# EAGLE design HV-PCB (EAGLE 7.7.0)
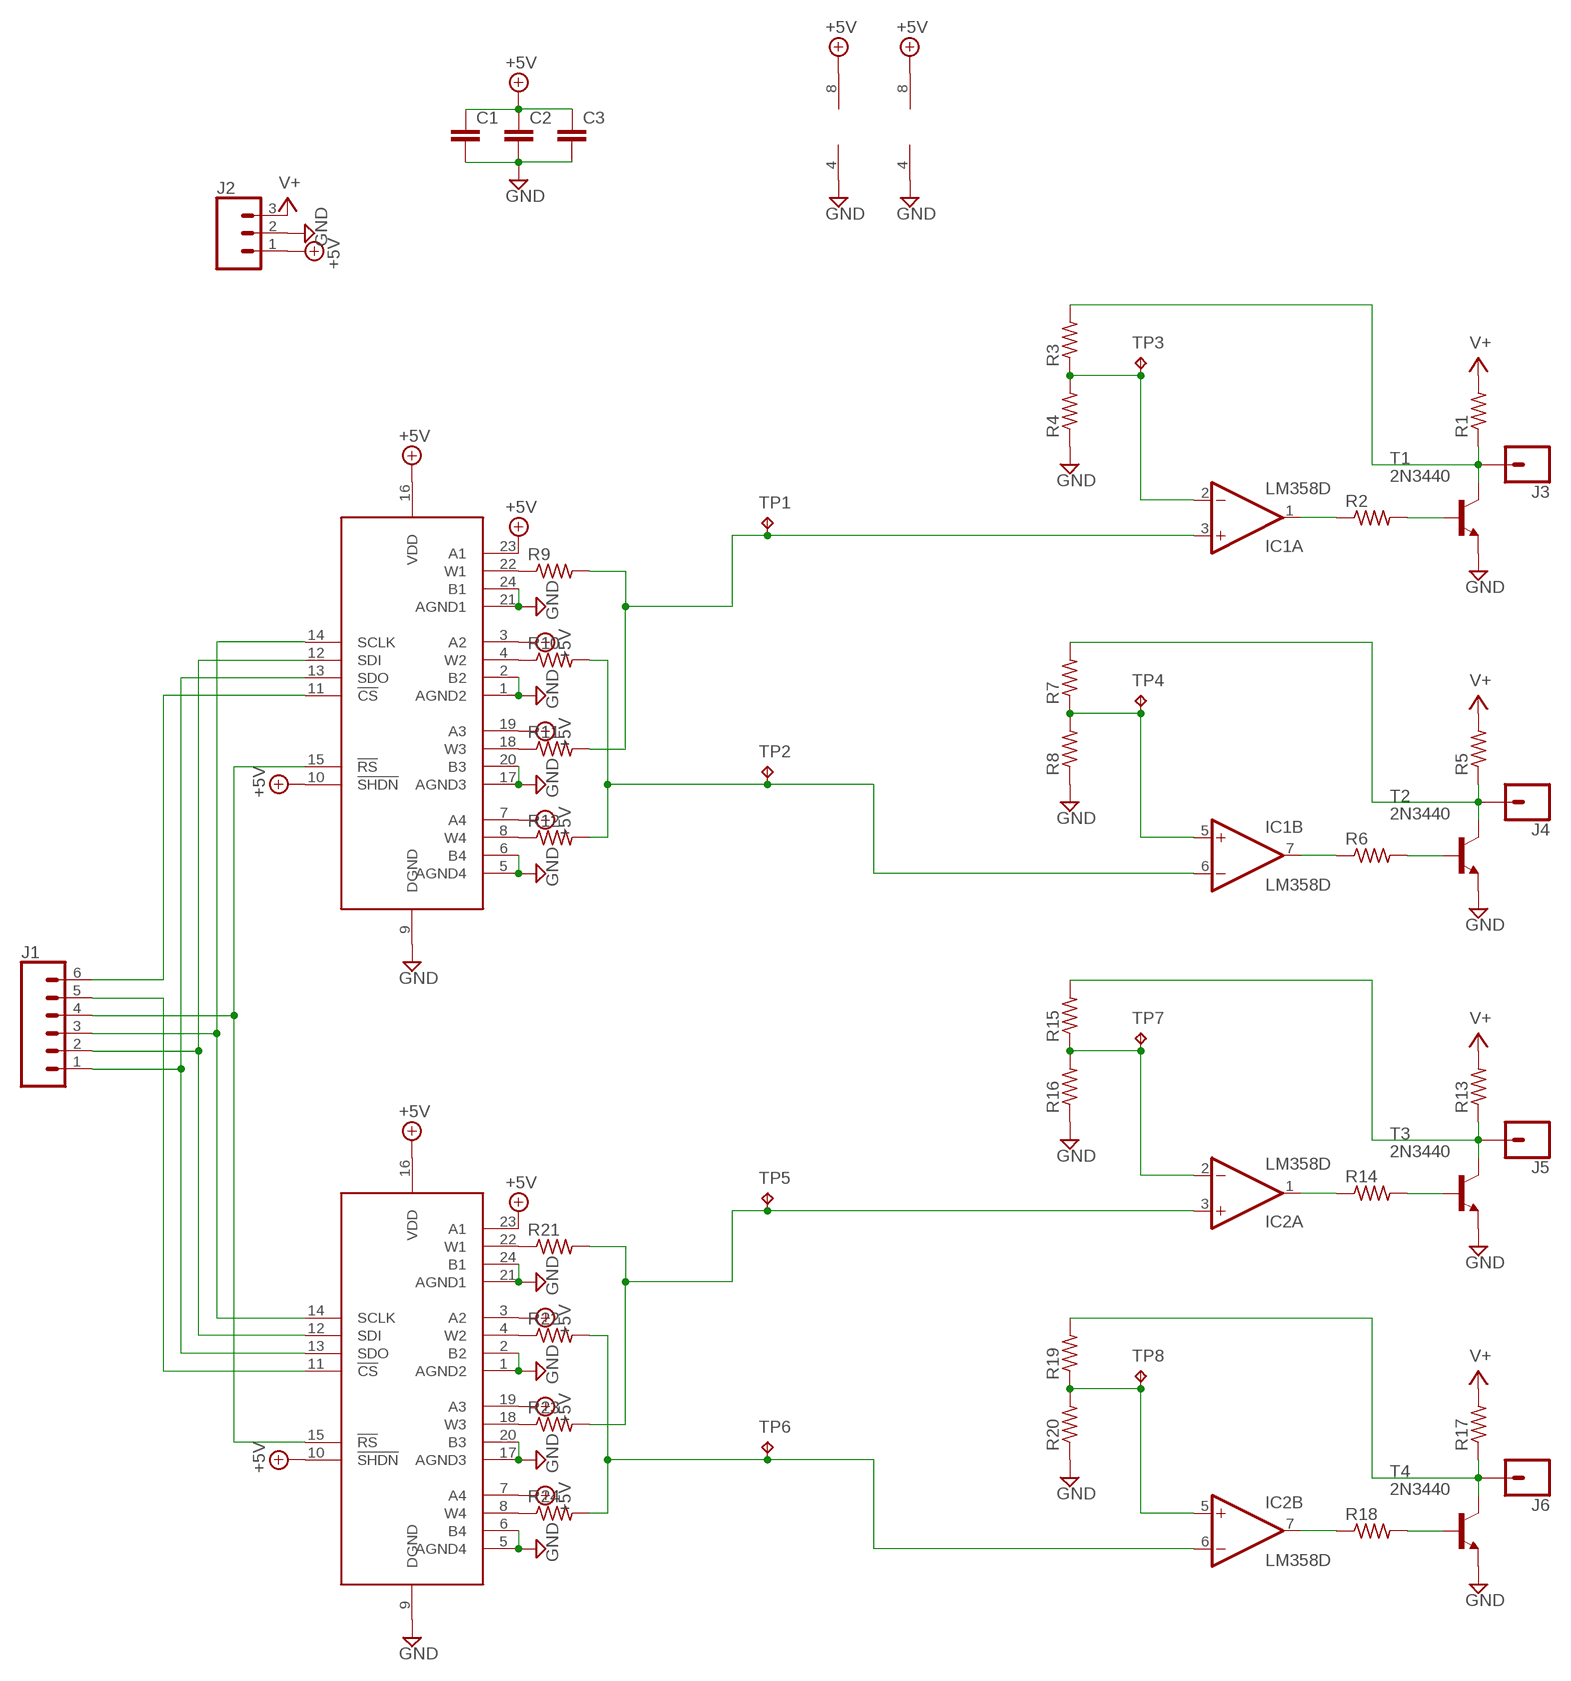
[diagram p0: schematic, sheet 1]

## Parts
C1  C-EUC1206K  [C1206K]
C2  C-EUC1206K  [C1206K]
C3  C-EUC1206K  [C1206K]
IC1  LM358D  [SO08]
IC2  LM358D  [SO08]
J1  CONN_06SILK_FEMALE_PTH  [1X06]
J2  CONN_03  [1X03]
J3  CONN_01  [1X01]
J4  CONN_01  [1X01]
J5  CONN_01  [1X01]
J6  CONN_01  [1X01]
R1  R-US_M1206  [M1206]
R2  R-US_M1206  [M1206]
R3  R-US_M1206  [M1206]
R4  R-US_M1206  [M1206]
R5  R-US_M1206  [M1206]
R6  R-US_M1206  [M1206]
R7  R-US_M1206  [M1206]
R8  R-US_M1206  [M1206]
R9  R-US_M1206  [M1206]
R10  R-US_M1206  [M1206]
R11  R-US_M1206  [M1206]
R12  R-US_M1206  [M1206]
R13  R-US_M1206  [M1206]
R14  R-US_M1206  [M1206]
R15  R-US_M1206  [M1206]
R16  R-US_M1206  [M1206]
R17  R-US_M1206  [M1206]
R18  R-US_M1206  [M1206]
R19  R-US_M1206  [M1206]
R20  R-US_M1206  [M1206]
R21  R-US_M1206  [M1206]
R22  R-US_M1206  [M1206]
R23  R-US_M1206  [M1206]
R24  R-US_M1206  [M1206]
T1  2N3440  [TO5]
T2  2N3440  [TO5]
T3  2N3440  [TO5]
T4  2N3440  [TO5]
TP1  TPB1,27  [B1,27]
TP2  TPB1,27  [B1,27]
TP3  TPB1,27  [B1,27]
TP4  TPB1,27  [B1,27]
TP5  TPB1,27  [B1,27]
TP6  TPB1,27  [B1,27]
TP7  TPB1,27  [B1,27]
TP8  TPB1,27  [B1,27]
U$1  AD8403  [SO24L]
U$2  AD8403  [SO24L]

## Nets
!RST: J1.4 U$1.15(!RS) U$2.15(!RS)
+5V: C1.1 C2.1 C3.1 IC1.8(P:V+) IC2.8(P:V+) J2.1 U$1.3(A2) U$1.7(A4) U$1.10(!SHDN) U$1.16(VDD) U$1.19(A3) U$1.23(A1) U$2.3(A2) U$2.7(A4) U$2.10(!SHDN) U$2.16(VDD) U$2.19(A3) U$2.23(A1)
GND: C1.2 C2.2 C3.2 IC1.4(P:V-) IC2.4(P:V-) J2.2 R4.1 R8.1 R16.1 R20.1 T1.1(E) T2.1(E) T3.1(E) T4.1(E) U$1.1(AGND2) U$1.2(B2) U$1.5(AGND4) U$1.6(B4) U$1.9(DGND) U$1.17(AGND3) U$1.20(B3) U$1.21(AGND1) U$1.24(B1) U$2.1(AGND2) U$2.2(B2) U$2.5(AGND4) U$2.6(B4) U$2.9(DGND) U$2.17(AGND3) U$2.20(B3) U$2.21(AGND1) U$2.24(B1)
N$1: J3.1 R1.1 R3.2 T1.3(C)
N$2: R2.2 T1.2(B)
N$3: IC1.1(A:OUT) R2.1
N$4: IC1.2(A:-IN) R3.1 R4.2 TP3.TP
N$5: J4.1 R5.1 R7.2 T2.3(C)
N$6: R6.2 T2.2(B)
N$7: IC1.7(B:OUT) R6.1
N$8: IC1.5(B:+IN) R7.1 R8.2 TP4.TP
N$9: R9.1 U$1.22(W1)
N$10: R10.1 U$1.4(W2)
N$11: IC1.3(A:+IN) R9.2 R11.2 TP1.TP
N$12: IC1.6(B:-IN) R10.2 R12.2 TP2.TP
N$13: R11.1 U$1.18(W3)
N$14: R12.1 U$1.8(W4)
N$15: J5.1 R13.1 R15.2 T3.3(C)
N$16: R14.2 T3.2(B)
N$17: IC2.1(A:OUT) R14.1
N$18: IC2.2(A:-IN) R15.1 R16.2 TP7.TP
N$19: J6.1 R17.1 R19.2 T4.3(C)
N$20: R18.2 T4.2(B)
N$21: IC2.7(B:OUT) R18.1
N$22: IC2.5(B:+IN) R19.1 R20.2 TP8.TP
N$23: R21.1 U$2.22(W1)
N$24: R22.1 U$2.4(W2)
N$25: IC2.3(A:+IN) R21.2 R23.2 TP5.TP
N$26: R23.1 U$2.18(W3)
N$27: R24.1 U$2.8(W4)
N$28: IC2.6(B:-IN) R22.2 R24.2 TP6.TP
N$29: J1.5 U$2.11(!CS)
N$30: J1.6 U$1.11(!CS)
SCLK: J1.3 U$1.14(SCLK) U$2.14(SCLK)
SDI: J1.2 U$1.12(SDI) U$2.12(SDI)
SDO: J1.1 U$1.13(SDO) U$2.13(SDO)
V+: J2.3 R1.2 R5.2 R13.2 R17.2

## Library data of the parts
C1-C3 = resistor:C-EU: CAPACITOR, European symbol
IC1 IC2 = linear:LM358: OP AMP also LM158; LM258; LM2904 Source: http://cache.national.com/ds/LM/LM158.pdf
J1 = SparkFun-Connectors:CONN_06: Multi connection point. Often used as Generic Header-pin footprint for 0.1 inch spaced/style header connections On any of the 0.1 inch spaced packages, you can populate with these: Break Away Headers - Straight <https://www.sparkfun.com/products/116> (PRT-00116) Break Away Male Headers - Right Angle <https://www.sparkfun.com/products/553> (PRT-00553) Female Headers <https://www.sparkfun.com/products/115> (PRT-00115) Break Away Headers - Machine Pin <https://www.sparkfun.com/products/117> (PRT-00117) Break Away Female Headers - Swiss Machine Pin <https://www.sparkfun.com/products/743> (PRT-00743) Arduino Stackable Header - 6 Pin <https://www.sparkfun.com/products/9280> (PRT-09280) For SCREWTERMINALS and SPRING TERMINALS visit here: Screw Terimnals on SparkFun.com <https://www.sparkfun.com/search/results?term=Screw+Terminals> (5mm/3.5mm/2.54mm spacing) This device is also useful as a general connection point to wire up your design to another part of your project. Our various solder wires solder well into these plated through hole pads. Hook-Up Wire - Assortment (Stranded, 22 AWG) <https://www.sparkfun.com/products/11375> (PRT-11375) Hook-Up Wire - Assortment (Solid Core, 22 AWG) <https://www.sparkfun.com/products/11367> (PRT-11367) View the entire wire category on our website here <https://www.sparkfun.com/categories/141>; PROD_ID: CONN-08437
J2 = SparkFun-Connectors:CONN_03: Multi connection point. Often used as Generic Header-pin footprint for 0.1 inch spaced/style header connections On any of the 0.1 inch spaced packages, you can populate with these: Break Away Headers - Straight <https://www.sparkfun.com/products/116> (PRT-00116) Break Away Male Headers - Right Angle <https://www.sparkfun.com/products/553> (PRT-00553) Female Headers <https://www.sparkfun.com/products/115> (PRT-00115) Break Away Headers - Machine Pin <https://www.sparkfun.com/products/117> (PRT-00117) Break Away Female Headers - Swiss Machine Pin <https://www.sparkfun.com/products/743> (PRT-00743) Stackable Header - 3 Pin (Female, 0.1") <https://www.sparkfun.com/products/13875> (PRT-13875) For SCREWTERMINALS and SPRING TERMINALS visit here: Screw Terimnals on SparkFun.com <https://www.sparkfun.com/search/results?term=Screw+Terminals> (5mm/3.5mm/2.54mm spacing) This device is also useful as a general connection point to wire up your design to another part of your project. Our various solder wires solder well into these plated through hole pads. Hook-Up Wire - Assortment (Stranded, 22 AWG) <https://www.sparkfun.com/products/11375> (PRT-11375) Hook-Up Wire - Assortment (Solid Core, 22 AWG) <https://www.sparkfun.com/products/11367> (PRT-11367) View the entire wire category on our website here <https://www.sparkfun.com/categories/141> Special notes: Molex polarized connector foot print use with SKU : PRT-08232 with associated crimp pins and housings.
J3-J6 = SparkFun-Connectors:CONN_01: Single connection point. Often used as Generic Header-pin footprint for 0.1 inch spaced/style header connections On any of the 0.1 inch spaced packages, you can populate with these: Break Away Headers - Straight <https://www.sparkfun.com/products/116> (PRT-00116) Break Away Male Headers - Right Angle <https://www.sparkfun.com/products/553> (PRT-00553) Female Headers <https://www.sparkfun.com/products/115> (PRT-00115) Break Away Headers - Machine Pin <https://www.sparkfun.com/products/117> (PRT-00117) Break Away Female Headers - Swiss Machine Pin <https://www.sparkfun.com/products/743> (PRT-00743) This device is also useful as a general connection point to wire up your design to another part of your project. Our various solder wires solder well into these plated through hole pads. Hook-Up Wire - Assortment (Stranded, 22 AWG) <https://www.sparkfun.com/products/11375> (PRT-11375) Hook-Up Wire - Assortment (Solid Core, 22 AWG) <https://www.sparkfun.com/products/11367> (PRT-11367) View the entire wire category on our website here <https://www.sparkfun.com/categories/141> Special notes: SMTSO-256-ET is a "flush mount" nut for a 4-40 screw. We mostly use this on specialty testbeds; it is a nice way to connect hardware to your PCB at an adjustable hieght. Also note, the SNAP packages are for using a snappable style connector. We sell a baggie of snaps and they are also used on two LilyPad designs: Snap Assortment - 30 pack (male and female) <https://www.sparkfun.com/products/11347> (DEV-11347) LilyPad Arduino SimpleSnap <https://www.sparkfun.com/products/10941> (DEV-10941) LilyPad SimpleSnap Protoboard <https://www.sparkfun.com/products/10940> (DEV-10940)
R1-R24 = resistor:R-US_: RESISTOR, American symbol
T1-T4 = transistor:2N3440: NPN TRANSISTOR
TP1-TP8 = testpad:TP: Test pad
U$1 U$2 = FRC696:AD8403

## Board
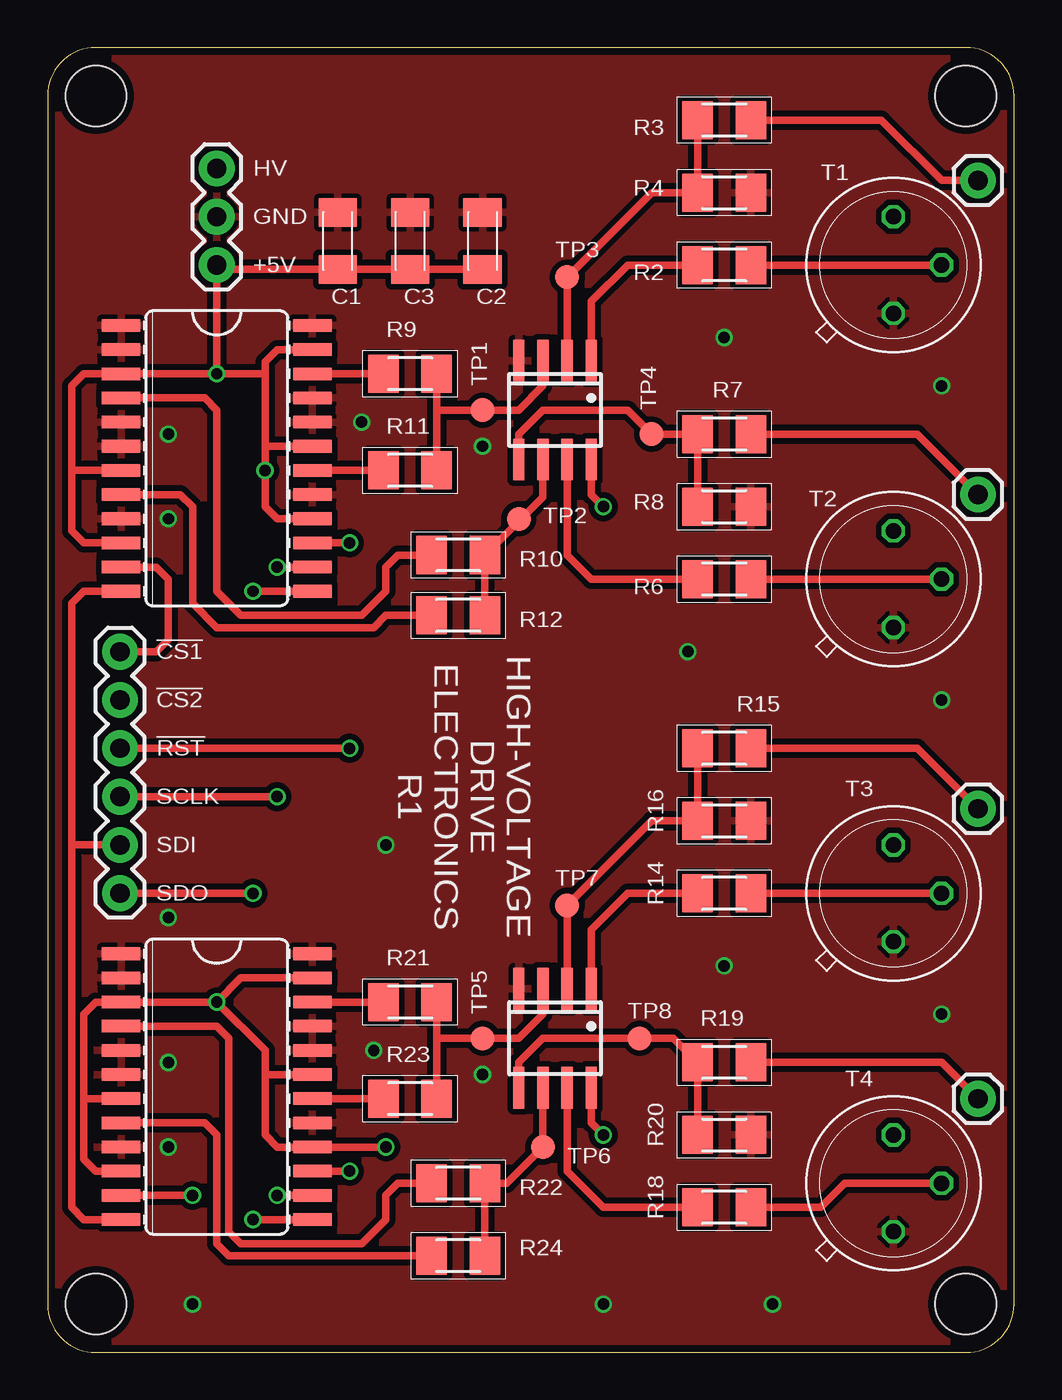
[diagram p1: board, top side]
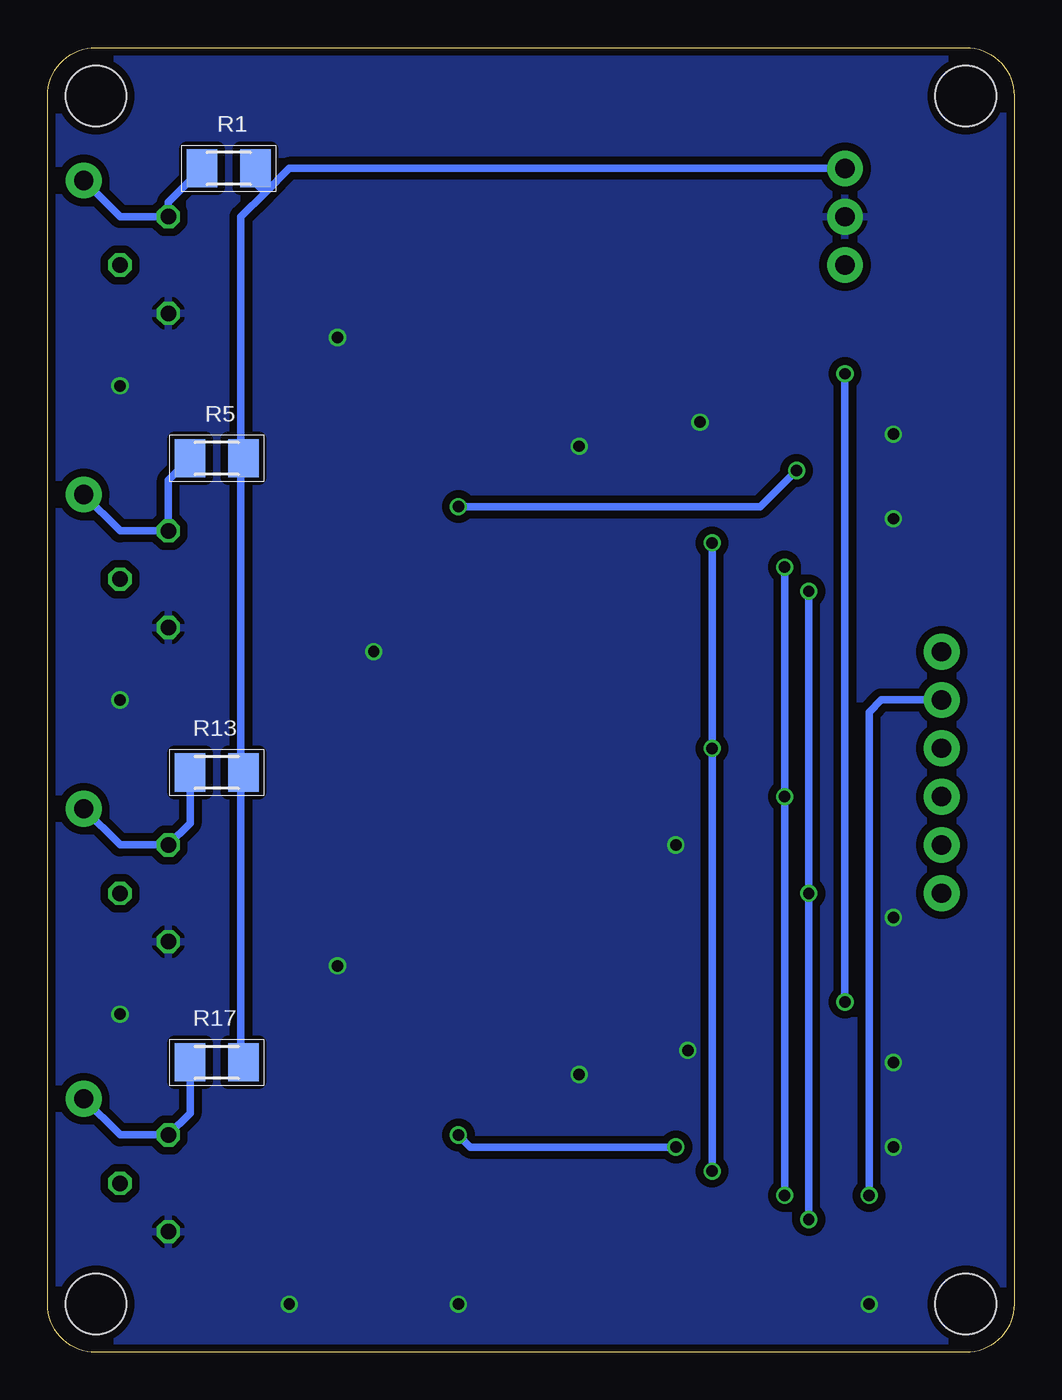
[diagram p2: board, bottom side, seen from below]

Size 50.8 x 68.58 mm. Coordinates in mm from the lower left corner, seen from the top.
Outline: 48.26,68.58 2.54,68.58 arc90 0,66.04 0,2.54 arc90 2.54,0 48.26,0 arc90 50.8,2.54 50.8,66.04 arc90 48.26,68.58
Copper layers (1*16): Top 0.035559375mm / dielectric 1.6mm / Bottom 0.035559375mm
Design rules "oshpark-2layer": minimum track width 6mil, minimum drill 10mil, track to track 6mil, track to pad 6mil, pad to pad 6mil, via to via 6mil, smd to smd 6mil, copper to edge 15mil, drill to drill 6mil, minimum pad ring 5mil, minimum via ring 5mil, stop-mask expansion 2.5mil, vias tented up to drill 0mil, thermal gap 10mil
Holes 3.2 mm at 48.26,2.54 48.26,66.04 2.54,66.04 2.54,2.54

### Footprints (pad centres in the part's own frame; a part is rotated, then mirrored left to right if it is on the bottom)
C1206K = smd 1.5 x 2: 1 -1.5,0; 2 1.5,0
SO08 = smd 0.6 x 2.2: 1 -1.905,-2.6; 2 -0.635,-2.6; 3 0.635,-2.6; 4 1.905,-2.6; 5 1.905,2.6; 6 0.635,2.6; 7 -0.635,2.6; 8 -1.905,2.6
1X06 = drill 1.016 pad 1.88: 1 0,0; 2 2.54,0; 3 5.08,0; 4 7.62,0; 5 10.16,0; 6 12.7,0
1X03 = drill 1.016 pad 1.88: 1 0,0; 2 2.54,0; 3 5.08,0
1X01 = drill 1.016 pad 1.88: 1 0,0
M1206 = smd 1.6 x 2: 1 -1.4,0; 2 1.4,0
TO5 = drill 0.813 octagon: 1 0,-2.54; 2 2.54,0; 3 0,2.54
B1,27 = smd 1.27 x 1.27: TP 0,0
SO24L = smd 0.66 x 2.032: 1 -6.985,-5.029; 2 -5.715,-5.029; 3 -4.445,-5.029; 4 -3.175,-5.029; 5 -1.905,-5.029; 6 -0.635,-5.029; 7 0.635,-5.029; 8 1.905,-5.029; 9 3.175,-5.029; 10 4.445,-5.029; 11 5.715,-5.029; 12 6.985,-5.029; 13 6.985,5.029; 14 5.715,5.029; 15 4.445,5.029; 16 3.175,5.029; 17 1.905,5.029; 18 0.635,5.029; 19 -0.635,5.029; 20 -1.905,5.029; 21 -3.175,5.029; 22 -4.445,5.029; 23 -5.715,5.029; 24 -6.985,5.029

### Placement (x,y rotation side)
C1  15.24,58.42 90 top
C2  22.86,58.42 90 top
C3  19.05,58.42 90 top
IC1  26.67,49.53 180 top
IC2  26.67,16.51 180 top
J1  3.81,24.13 90 top
J2  8.89,57.15 90 top
J3  48.9,61.59 0 top
J4  48.9,45.09 0 top
J5  48.9,28.57 0 top
J6  48.9,13.34 0 top
R1  41.27,62.23 0 bottom
R2  35.56,57.15 0 top
R3  35.56,64.77 0 top
R4  35.56,60.96 180 top
R5  41.91,46.99 0 bottom
R6  35.56,40.64 0 top
R7  35.56,48.26 0 top
R8  35.56,44.45 180 top
R9  19.05,51.44 0 top
R10  21.59,41.91 0 top
R11  19.05,46.35 0 top
R12  21.59,38.73 0 top
R13  41.91,30.48 0 bottom
R14  35.56,24.13 0 top
R15  35.56,31.75 0 top
R16  35.56,27.94 180 top
R17  41.91,15.24 0 bottom
R18  35.56,7.62 0 top
R19  35.56,15.24 0 top
R20  35.56,11.43 180 top
R21  19.05,18.41 0 top
R22  21.59,8.89 0 top
R23  19.05,13.34 0 top
R24  21.59,5.08 0 top
T1  44.45,57.15 0 top
T2  44.45,40.64 0 top
T3  44.45,24.13 0 top
T4  44.45,8.89 0 top
TP1  22.86,49.53 0 top
TP2  24.77,43.81 0 top
TP3  27.3,56.52 0 top
TP4  31.75,48.26 0 top
TP5  22.86,16.51 0 top
TP6  26.04,10.79 0 top
TP7  27.3,23.5 0 top
TP8  31.11,16.51 0 top
U$1  8.89,46.99 270 top
U$2  8.89,13.97 270 top

### Tracks (layer width: path | path; a pad name or v marks a point on that pad's centre or on a via)
!RST  (via drill 0.6)
  Top 0.406: U$2.15 v15.88,9.53 | v15.88,42.55 U$1.15 | J1.4 v15.88,31.75
  Bottom 0.406: v15.88,9.53 v15.88,31.75 v15.88,42.55
+5V  (via drill 0.6)
  Top 0.406: U$1.16 12.06,43.81 11.43,44.45 v11.43,46.35 11.43,47.62 | 11.43,47.62 11.43,51.44 | 11.43,51.44 11.43,52.07 12.06,52.7 U$1.23 | U$1.19 11.43,47.62 | v8.89,51.44 U$1.3 1.91,51.44 1.27,50.8 1.27,46.35 | v8.89,51.44 11.43,51.44 | U$2.10 2.54,9.53 1.91,10.16 1.91,13.34 | 1.91,13.34 U$2.7 | 1.91,13.34 1.91,17.78 2.54,18.41 U$2.3 v8.89,18.41 | v8.89,18.41 10.16,19.68 U$2.23 | 11.43,14.61 11.43,11.43 12.06,10.79 U$2.16 v17.78,10.79 | 11.43,14.61 11.43,15.88 v8.89,18.41 | U$2.19 11.43,14.61 | U$1.10 1.91,42.55 1.27,43.18 1.27,46.35 | v8.89,51.44 J2.1 9.12,56.92 C1.1 C3.1 C2.1 | IC1.8 28.57,45.09 v29.21,44.45 | U$1.7 1.27,46.35 | IC2.8 28.57,12.06 v29.21,11.43
  Bottom 0.406: v29.21,44.45 13.34,44.45 v11.43,46.35 | v8.89,51.44 v8.89,18.41 | v29.21,11.43 28.57,10.79 v17.78,10.79
GND  (via drill 0.6)
  other vias: 6.35,10.79 6.35,22.86 17.78,26.67 33.66,36.83 6.35,15.24 6.35,48.26 6.35,43.81 35.56,53.34 46.99,50.8 46.99,34.29 38.1,2.54 29.21,2.54 7.62,2.54 35.56,20.32 46.99,17.78 16.51,48.9 22.86,47.62 17.14,15.88 22.86,14.61
  pour Top (isolate 0.305): -6.35,72.39 58.42,72.39 58.42,-5.08 -6.35,-5.08
  pour Bottom (isolate 0.406): -25.4,72.39 76.2,72.39 76.2,-13.97 -25.4,-13.97
N$1
  Top 0.406: R3.2 43.81,64.77 46.99,61.59 J3.1
  Bottom 0.406: J3.1 46.99,59.69 T1.3 44.45,60.45 R1.1
N$2
  Top 0.406: R2.2 T1.2
N$3
  Top 0.406: IC1.1 28.57,55.24 30.48,57.15 R2.1
N$4
  Top 0.406: R3.1 R4.2 31.75,60.96 TP3.TP IC1.2
N$5
  Top 0.406: J4.1 45.72,48.26 R7.2
  Bottom 0.406: J4.1 46.99,43.18 T2.3 44.45,45.85 R5.1
N$6
  Top 0.406: R6.2 T2.2
N$7
  Top 0.406: R6.1 28.57,40.64 27.3,41.91 IC1.7
N$8
  Top 0.406: R8.2 R7.1 TP4.TP 30.48,49.53 26.04,49.53 24.77,48.26 IC1.5
N$9
  Top 0.406: R9.1 U$1.22
N$10
  Top 0.406: U$1.4 8.26,50.16 8.89,49.53 8.89,40.01 10.16,38.73 16.51,38.73 17.78,40.01 17.78,41.27 18.41,41.91 R10.1
N$11
  Top 0.406: R11.2 20.45,49.53 | 20.45,49.53 R9.2 | IC1.3 26.04,50.8 24.77,49.53 TP1.TP 20.45,49.53
N$12
  Top 0.406: R12.2 R10.2 24.89,43.81 | IC1.6 26.04,44.95 24.89,43.81 | TP2.TP 24.89,43.81
N$13
  Top 0.406: R11.1 U$1.18
N$14
  Top 0.406: U$1.8 6.99,45.09 7.62,44.45 7.62,39.37 8.89,38.1 17.14,38.1 17.78,38.73 R12.1
N$15
  Top 0.406: R15.2 45.72,31.75 J5.1
  Bottom 0.406: J5.1 46.99,26.67 T3.3 43.31,27.81 R13.1
N$16
  Top 0.406: T3.2 R14.2
N$17
  Top 0.406: IC2.1 28.57,22.23 30.48,24.13 R14.1
N$18
  Top 0.406: R15.1 R16.2 31.75,27.94 TP7.TP IC2.2 27.3,19.05
N$19
  Top 0.406: R19.2 46.99,15.24 J6.1
  Bottom 0.406: J6.1 46.99,11.43 T4.3 43.31,12.57 R17.1
N$20
  Top 0.406: T4.2 41.91,8.89 40.64,7.62 R18.2
N$21
  Top 0.406: IC2.7 27.3,9.53 29.21,7.62 R18.1
N$22
  Top 0.406: R20.2 R19.1 32.89,16.51 TP8.TP 26.04,16.51 24.77,15.24 IC2.5
N$23
  Top 0.406: U$2.22 R21.1
N$24
  Top 0.406: U$2.4 8.89,17.14 9.53,16.51 9.53,6.35 10.16,5.71 16.51,5.71 17.78,6.99 17.78,8.26 18.41,8.89 R22.1
N$25
  Top 0.406: R23.2 20.45,16.51 | 20.45,16.51 R21.2 | IC2.3 26.04,17.78 24.77,16.51 TP5.TP 20.45,16.51
N$26
  Top 0.406: U$2.18 R23.1
N$27
  Top 0.406: U$2.8 8.26,12.06 8.89,11.43 8.89,5.71 9.53,5.08 R24.1
N$28
  Top 0.406: IC2.6 TP6.TP 24.13,8.89 R22.2 R24.2
N$29  (via drill 0.6)
  Top 0.406: U$2.11 v7.62,8.26
  Bottom 0.406: v7.62,8.26 7.62,33.66 6.99,34.29 J1.5
N$30
  Top 0.406: U$1.11 5.71,41.27 6.35,40.64 6.35,37.47 5.71,36.83 J1.6
SCLK  (via drill 0.6)
  Top 0.406: U$1.14 v12.06,41.27 | v12.06,8.26 U$2.14 | J1.3 v12.06,29.21
  Bottom 0.406: v12.06,41.27 v12.06,29.21 v12.06,8.26
SDI
  Top 0.406: U$1.12 1.91,40.01 1.27,39.37 1.27,26.67 | 1.27,26.67 1.27,7.62 1.91,6.99 U$2.12 | J1.2 1.27,26.67
SDO  (via drill 0.6)
  Top 0.406: U$2.13 v10.79,6.99 | v10.79,40.01 U$1.13 | J1.1 v10.79,24.13
  Bottom 0.406: v10.79,6.99 v10.79,24.13 v10.79,40.01
V+
  Bottom 0.406: 40.64,46.99 40.64,59.69 39.37,60.96 | 40.64,46.99 40.64,30.48 | 40.64,30.48 40.64,15.37 R17.2 | J2.3 38.1,62.23 39.37,60.96 | R5.2 40.64,46.99 | R1.2 39.88,61.47 39.37,60.96 | R13.2 40.64,30.48

### Text on the board
tPlace: HV | GND | +5V | !CS1 | !CS2 | !RST | SCLK | R1 | ELECTRONICS | DRIVE | HIGH-VOLTAGE | SDI | SDO